# EAGLE schematic double-tube (EAGLE 6.6.0)
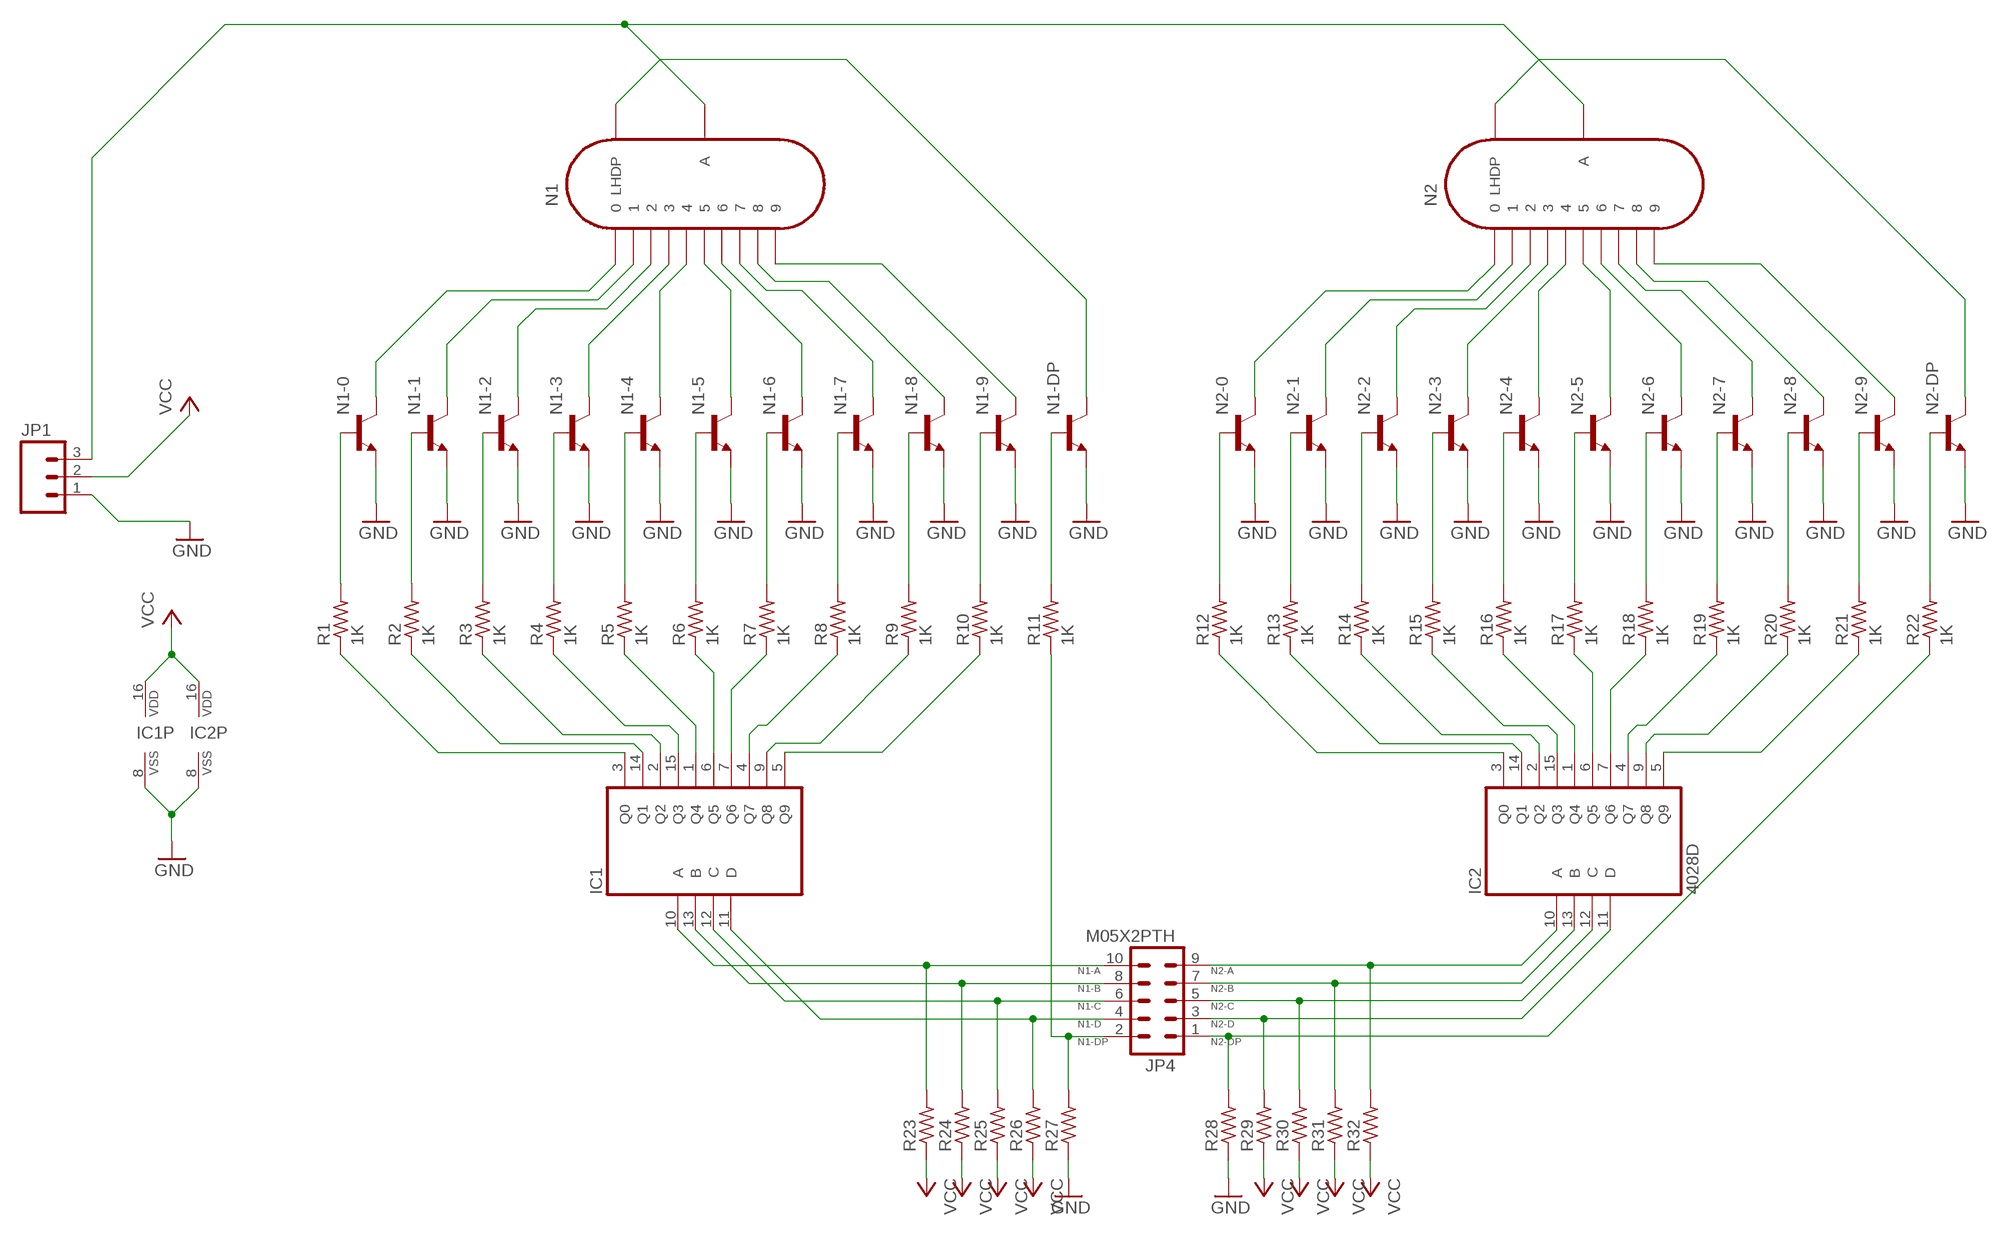
[diagram p0: schematic, sheet 1]

## Parts
IC1  4028D  [SO16]
IC2  4028D  [SO16]
JP1  M03PTH  [1X03]
JP4  M05X2PTH  [AVR_ICSP]
N1  IN-12B  [IN-12]
N1-0  NPN_SMD  [SOT-23]
N1-1  NPN_SMD  [SOT-23]
N1-2  NPN_SMD  [SOT-23]
N1-3  NPN_SMD  [SOT-23]
N1-4  NPN_SMD  [SOT-23]
N1-5  NPN_SMD  [SOT-23]
N1-6  NPN_SMD  [SOT-23]
N1-7  NPN_SMD  [SOT-23]
N1-8  NPN_SMD  [SOT-23]
N1-9  NPN_SMD  [SOT-23]
N1-DP  NPN_SMD  [SOT-23]
N2  IN-12B  [IN-12]
N2-0  NPN_SMD  [SOT-23]
N2-1  NPN_SMD  [SOT-23]
N2-2  NPN_SMD  [SOT-23]
N2-3  NPN_SMD  [SOT-23]
N2-4  NPN_SMD  [SOT-23]
N2-5  NPN_SMD  [SOT-23]
N2-6  NPN_SMD  [SOT-23]
N2-7  NPN_SMD  [SOT-23]
N2-8  NPN_SMD  [SOT-23]
N2-9  NPN_SMD  [SOT-23]
N2-DP  NPN_SMD  [SOT-23]
R1  1K  RESISTORR0603  [R0603]
R2  1K  RESISTORR0603  [R0603]
R3  1K  RESISTORR0603  [R0603]
R4  1K  RESISTORR0603  [R0603]
R5  1K  RESISTORR0603  [R0603]
R6  1K  RESISTORR0603  [R0603]
R7  1K  RESISTORR0603  [R0603]
R8  1K  RESISTORR0603  [R0603]
R9  1K  RESISTORR0603  [R0603]
R10  1K  RESISTORR0603  [R0603]
R11  1K  RESISTORR0603  [R0603]
R12  1K  RESISTORR0603  [R0603]
R13  1K  RESISTORR0603  [R0603]
R14  1K  RESISTORR0603  [R0603]
R15  1K  RESISTORR0603  [R0603]
R16  1K  RESISTORR0603  [R0603]
R17  1K  RESISTORR0603  [R0603]
R18  1K  RESISTORR0603  [R0603]
R19  1K  RESISTORR0603  [R0603]
R20  1K  RESISTORR0603  [R0603]
R21  1K  RESISTORR0603  [R0603]
R22  1K  RESISTORR0603  [R0603]
R23  RESISTORR0603  [R0603]
R24  RESISTORR0603  [R0603]
R25  RESISTORR0603  [R0603]
R26  RESISTORR0603  [R0603]
R27  RESISTORR0603  [R0603]
R28  RESISTORR0603  [R0603]
R29  RESISTORR0603  [R0603]
R30  RESISTORR0603  [R0603]
R31  RESISTORR0603  [R0603]
R32  RESISTORR0603  [R0603]

## Nets
180V: JP1.3 N1.A N2.A
GND: IC1.8(VSS) IC2.8(VSS) JP1.1 N1-0.2(E) N1-1.2(E) N1-2.2(E) N1-3.2(E) N1-4.2(E) N1-5.2(E) N1-6.2(E) N1-7.2(E) N1-8.2(E) N1-9.2(E) N1-DP.2(E) N2-0.2(E) N2-1.2(E) N2-2.2(E) N2-3.2(E) N2-4.2(E) N2-5.2(E) N2-6.2(E) N2-7.2(E) N2-8.2(E) N2-9.2(E) N2-DP.2(E) R27.1 R28.1
N1-A: IC1.10(A) JP4.10 R23.2
N1-B: IC1.13(B) JP4.8 R24.2
N1-C: IC1.12(C) JP4.6 R25.2
N1-D: IC1.11(D) JP4.4 R26.2
N1-DP: JP4.2 R11.1 R27.2
N2-0: N2-0.3(C) N2.0
N2-A: IC2.10(A) JP4.9 R32.2
N2-B: IC2.13(B) JP4.7 R31.2
N2-C: IC2.12(C) JP4.5 R30.2
N2-D: IC2.11(D) JP4.3 R29.2
N2-DP: JP4.1 R22.1 R28.2
N$1: N1-0.3(C) N1.0
N$2: N1-1.3(C) N1.1
N$3: N1-2.3(C) N1.2
N$4: N1-3.3(C) N1.3
N$5: N1-4.3(C) N1.4
N$6: N1-9.3(C) N1.9
N$7: N1-8.3(C) N1.8
N$8: N1-7.3(C) N1.7
N$9: N1-6.3(C) N1.6
N$10: N1-5.3(C) N1.5
N$11: N1-DP.3(C) N1.LHDP
N$12: N1-0.1(B) R1.2
N$13: N1-1.1(B) R2.2
N$14: N1-2.1(B) R3.2
N$15: N1-3.1(B) R4.2
N$16: N1-4.1(B) R5.2
N$17: N1-5.1(B) R6.2
N$18: N1-9.1(B) R10.2
N$19: N1-6.1(B) R7.2
N$20: N1-7.1(B) R8.2
N$21: N1-8.1(B) R9.2
N$22: IC1.3(Q0) R1.1
N$23: IC1.14(Q1) R2.1
N$28: N1-DP.1(B) R11.2
N$29: IC1.2(Q2) R3.1
N$30: N2-1.3(C) N2.1
N$31: N2-2.3(C) N2.2
N$32: N2-3.3(C) N2.3
N$33: N2-4.3(C) N2.4
N$34: N2-9.3(C) N2.9
N$35: N2-8.3(C) N2.8
N$36: N2-7.3(C) N2.7
N$37: N2-6.3(C) N2.6
N$38: N2-5.3(C) N2.5
N$39: N2-DP.3(C) N2.LHDP
N$40: N2-0.1(B) R12.2
N$41: N2-1.1(B) R13.2
N$42: N2-2.1(B) R14.2
N$43: N2-3.1(B) R15.2
N$44: N2-4.1(B) R16.2
N$45: N2-5.1(B) R17.2
N$46: N2-9.1(B) R21.2
N$47: N2-6.1(B) R18.2
N$48: N2-7.1(B) R19.2
N$49: N2-8.1(B) R20.2
N$50: IC1.15(Q3) R4.1
N$55: N2-DP.1(B) R22.2
N$56: IC1.1(Q4) R5.1
N$57: IC1.6(Q5) R6.1
N$58: IC1.7(Q6) R7.1
N$59: IC1.5(Q9) R10.1
N$60: IC1.9(Q8) R9.1
N$61: IC1.4(Q7) R8.1
N$63: IC2.3(Q0) R12.1
N$64: IC2.14(Q1) R13.1
N$65: IC2.2(Q2) R14.1
N$66: IC2.15(Q3) R15.1
N$67: IC2.1(Q4) R16.1
N$68: IC2.6(Q5) R17.1
N$69: IC2.7(Q6) R18.1
N$70: IC2.5(Q9) R21.1
N$71: IC2.9(Q8) R20.1
N$72: IC2.4(Q7) R19.1
VCC: IC1.16(VDD) IC2.16(VDD) JP1.2 R23.1 R24.1 R25.1 R26.1 R29.1 R30.1 R31.1 R32.1

## Library data of the parts
IC1 IC2 = iStivi - ICs:4028: BCD to decimal DECODER
JP1 = iStivi - Header-Connector:M03: Header 3 Standard 3-pin 0.1" header. Use with straight break away headers (SKU : PRT-00116), right angle break away headers (PRT-00553), swiss pins (PRT-00743), machine pins (PRT-00117), and female headers (PRT-00115). Molex polarized connector foot print use with SKU : PRT-08232 with associated crimp pins and housings.
JP4 = iStivi - Header-Connector:M05X2: Header 5x2 Standard 10-pin dual row 0.1" header. Commonly used with AVR-ISP. Use with Spark Fun Electronics SKU: PRT-00778
N1 N2 = iStivi - Tubes:IN-12B: IN-12B: medium numeric topview nixie tube
N1-0 N1-1-N1-9 N1-DP N2-0 N2-1-N2-9 N2-DP = iStivi - Transistor-FET-reg:NPN_SMD: NPN Transistor NPN transistor with smd package BC817 PMBTA42
R1-R32 = iStivi - RCLD:RESISTOR: RESISTOR